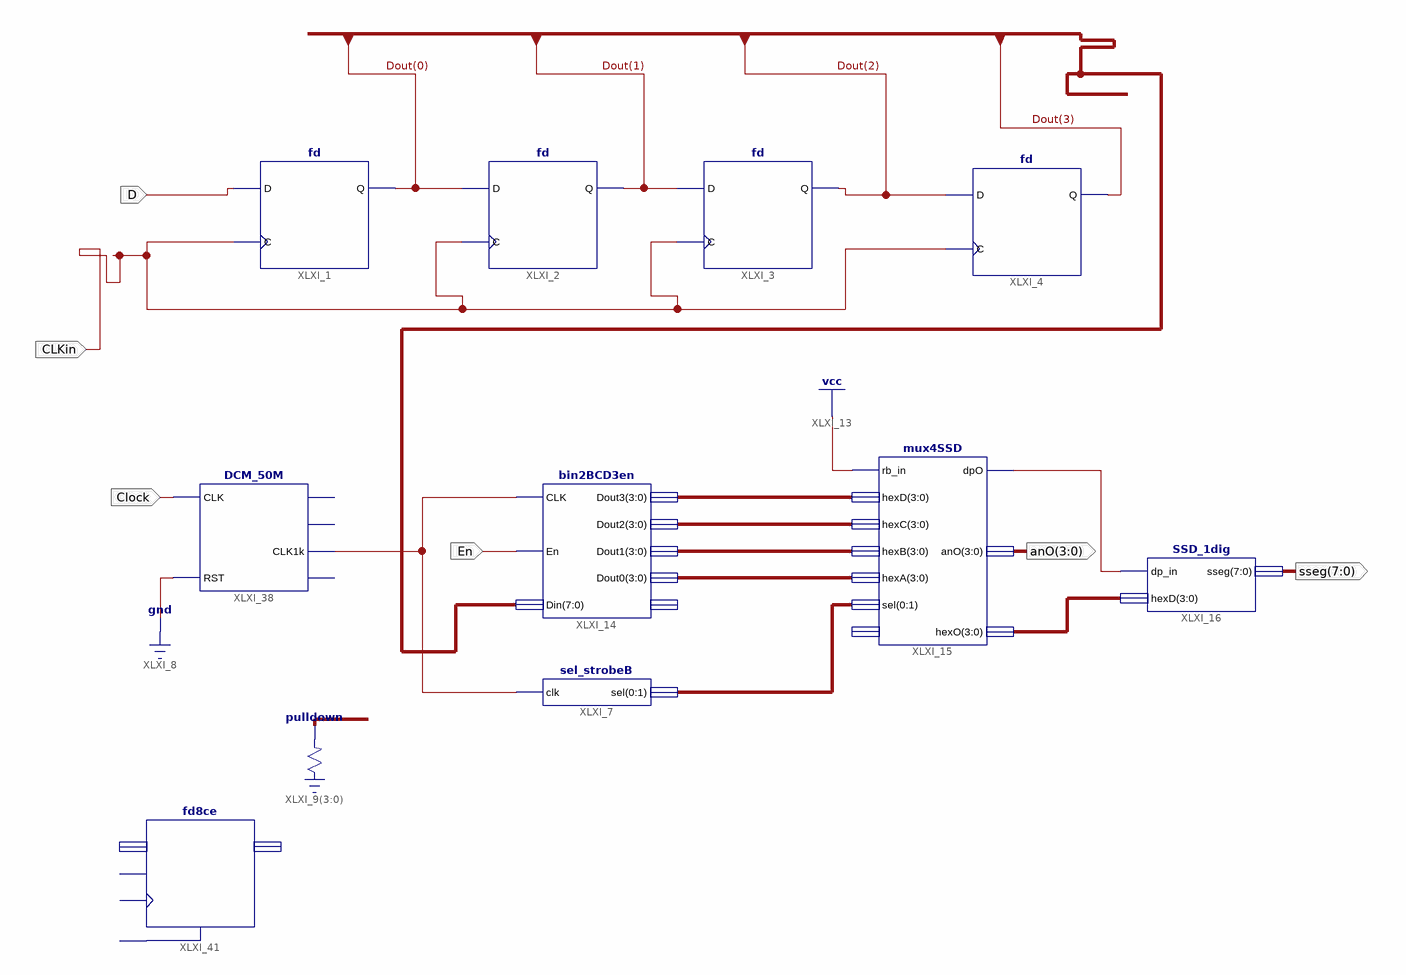
[diagram p0: schematic sheet 1]
// Xilinx ISE schematic lab7_shiftreg4.sch (spartan3e) as structural Verilog: 11 symbols, 6 ports
module lab7_shiftreg4 (
  input  CLKin,
  input  D,
  input  En,
  input  Clock,
  output [7:0] sseg,
  output [3:0] anO
);

  wire XLXN_84, XLXN_86;
  wire [1:0] XLXN_15;
  wire [3:0] XLXN_6, XLXN_7, XLXN_8, XLXN_9, XLXN_13;
  wire [7:0] Dout;

  fd XLXI_3 (.C(CLKin), .D(Dout[1]), .Q(Dout[2]));
  fd XLXI_4 (.C(CLKin), .D(Dout[2]), .Q(Dout[3]));
  fd XLXI_2 (.C(CLKin), .D(Dout[0]), .Q(Dout[1]));
  fd XLXI_1 (.C(CLKin), .D(D), .Q(Dout[0]));
  sel_strobeB XLXI_7 (.clk(XLXN_84), .sel({XLXN_15[0], XLXN_15[1]}));
  bin2BCD3en XLXI_14 (
    .CLK(XLXN_84), .En(En), .Din(Dout), .Dout3(XLXN_9), .Dout2(XLXN_8), .Dout1(XLXN_7), .Dout0(XLXN_6));  // open: RBout
  mux4SSD XLXI_15 (
    .rb_in(1'b1), .hexD(XLXN_9), .hexC(XLXN_8), .hexB(XLXN_7), .hexA(XLXN_6), .sel({XLXN_15[0], XLXN_15[1]}),
    .dpO(XLXN_86), .anO(anO), .hexO(XLXN_13));  // open: dp_in
  SSD_1dig XLXI_16 (.dp_in(XLXN_86), .hexD(XLXN_13), .sseg(sseg));
  \pulldown  XLXI_9[3:0] (.O(Dout[7:4]));
  DCM_50M XLXI_38 (.CLK(Clock), .RST(1'b0), .CLK1k(XLXN_84));  // open: CLK1M, CLK10k, CLK1
  fd8ce XLXI_41 ();  // open: C, CE, CLR, D, Q
endmodule
